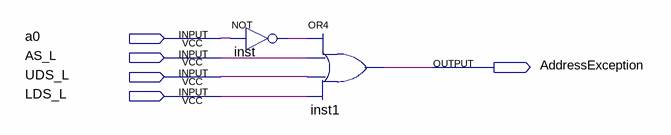
[diagram p0: schematic sheet]
// Quartus schematic AddressException.bdf as structural Verilog: 2 symbols, 5 pins
module AddressException (
  input  a0,
  input  AS_L,
  input  UDS_L,
  input  LDS_L,
  output AddressException
);

  wire inst_out;

  not inst (inst_out, a0);
  or inst1 (AddressException, inst_out, AS_L, UDS_L, LDS_L);
endmodule
